# Altium project Digital Power Board Rev2.PrjPcb
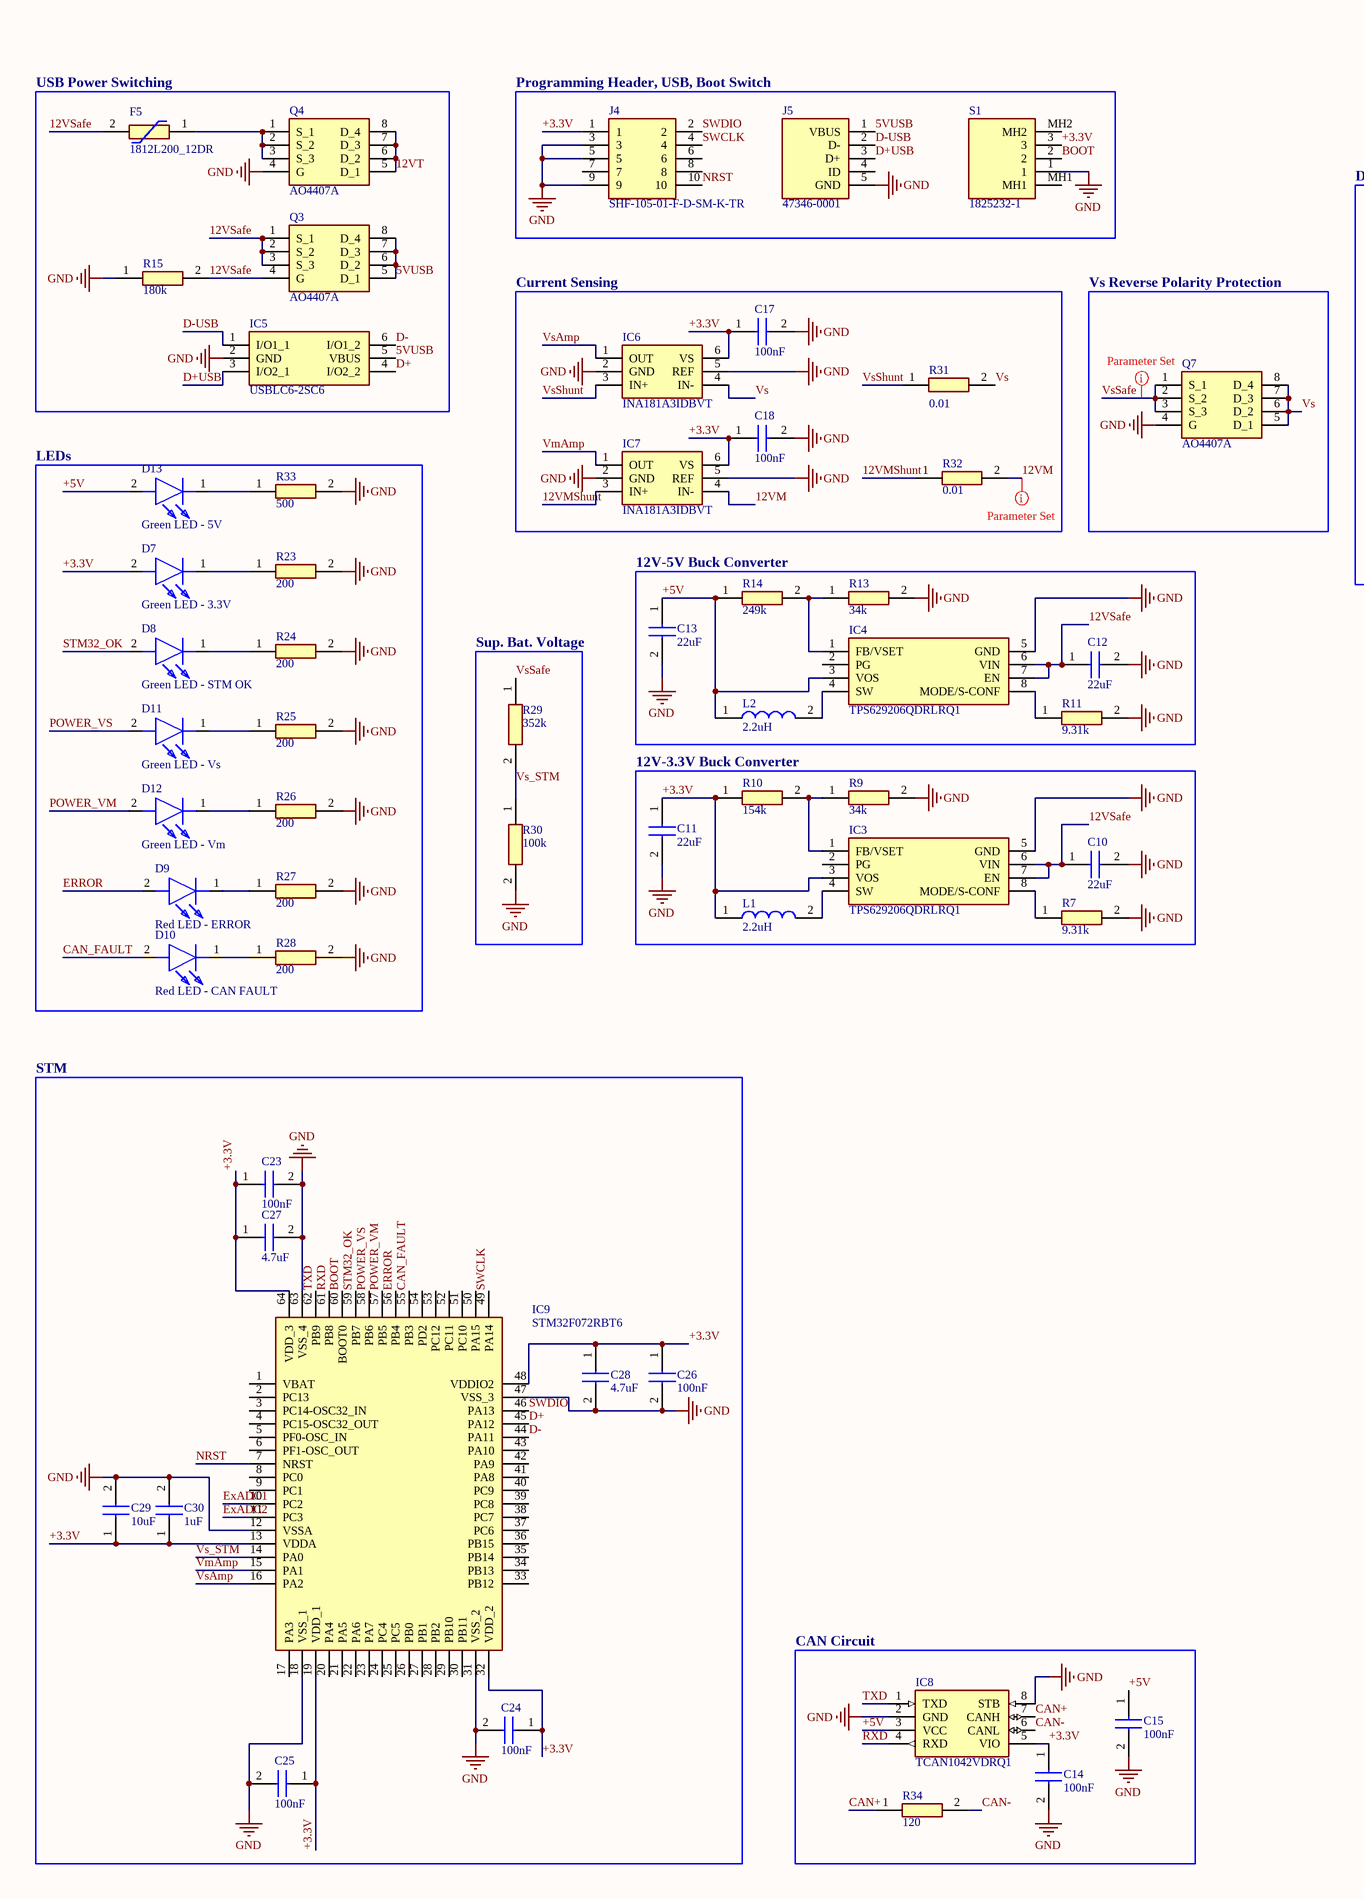
[diagram p0: PB-SG-Digital1-rev2.SchDoc, left]
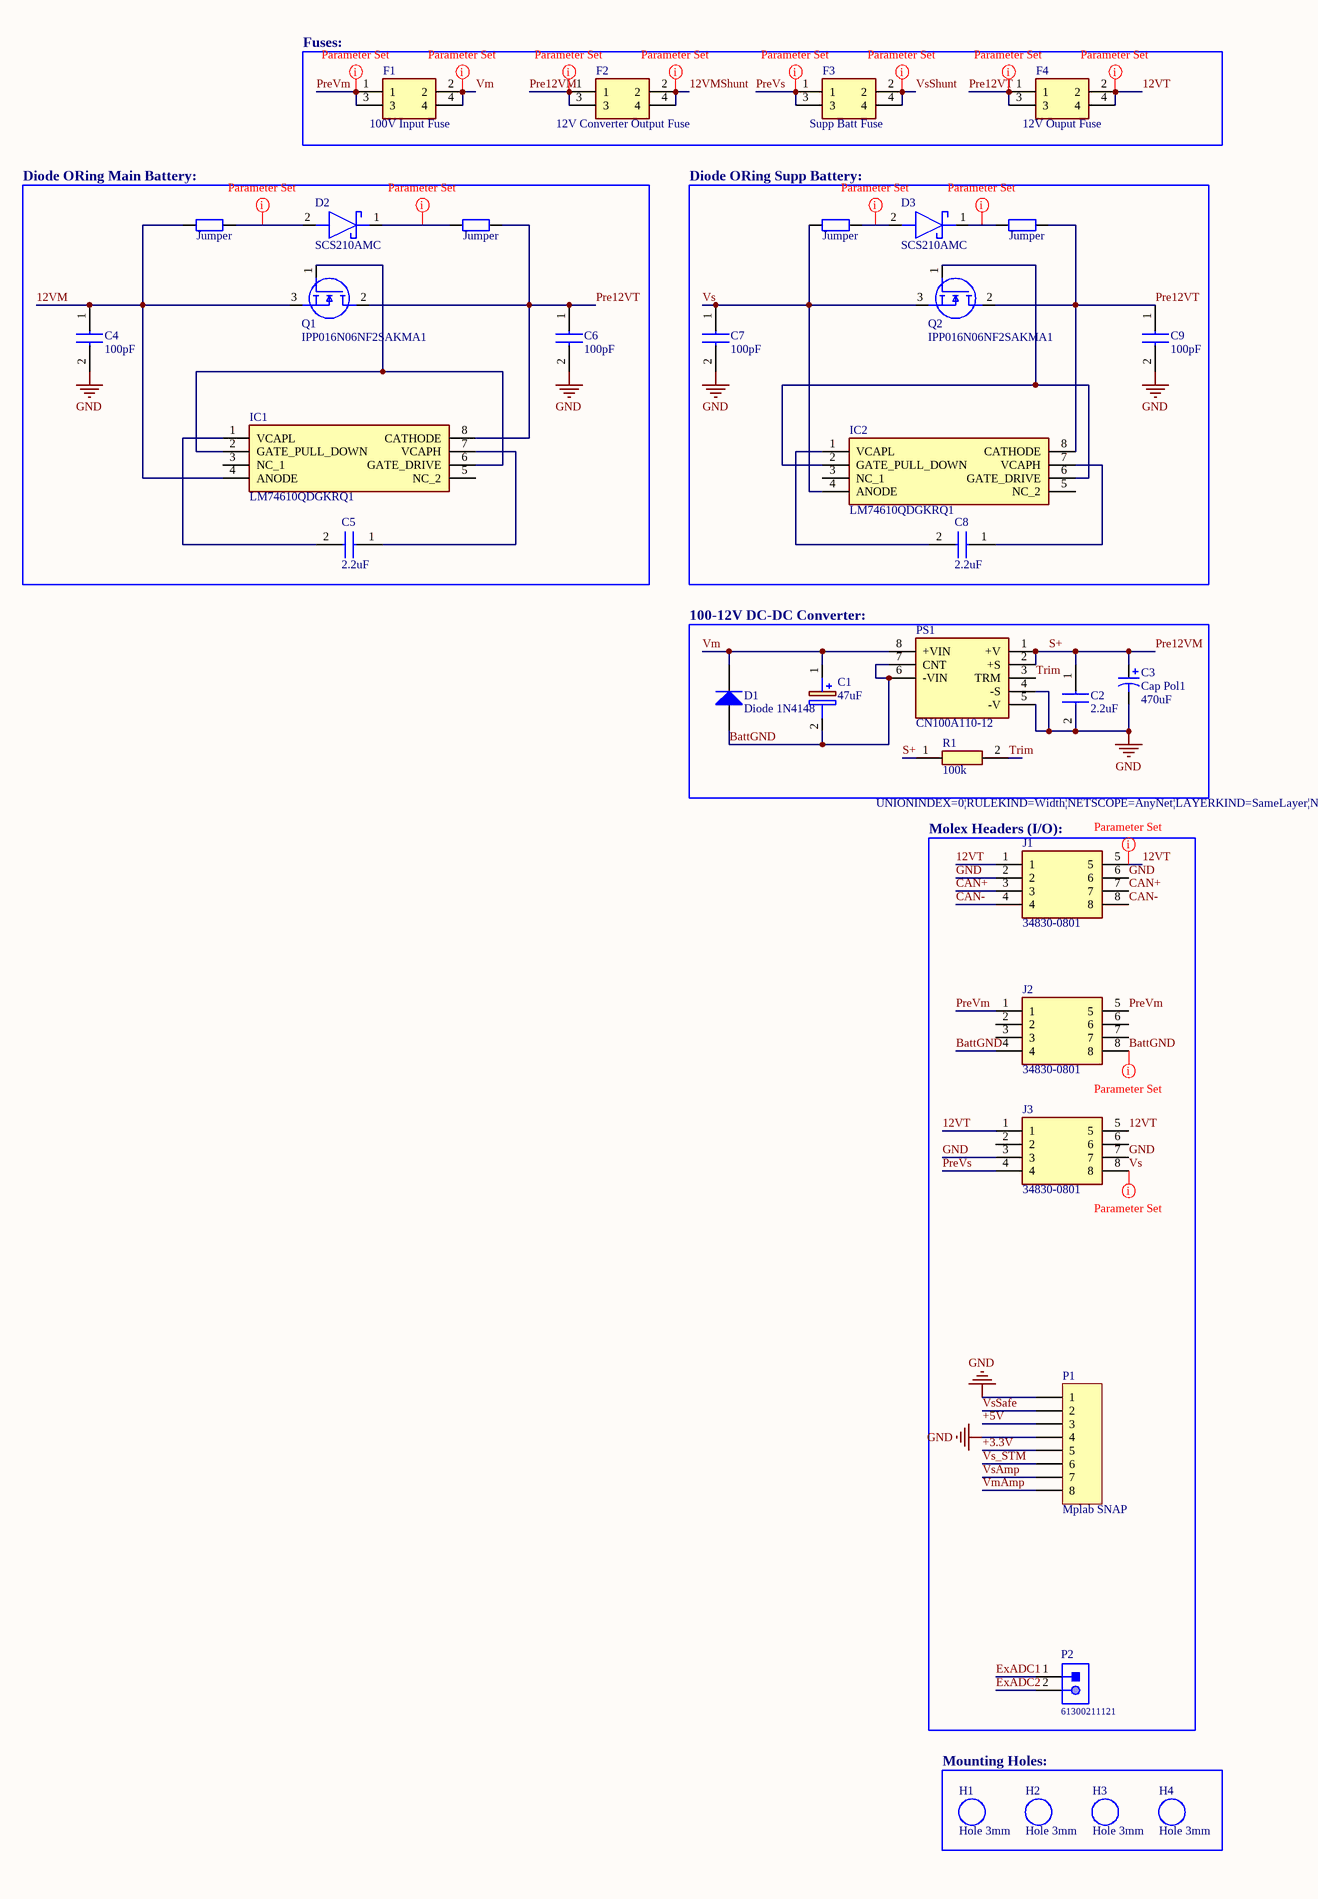
[diagram p1: PB-SG-Digital1-rev2.SchDoc, right]
1 sheet, 93 parts. Net scope: global (net labels, ports and power ports of the same name join across sheets).
Board file: PB-SG-Digital1-rev2.PcbDoc

## Sheet PB-SG-Digital1-rev2.SchDoc: Digital Power Board
size C; Author: Christian Michaelis; CompanyName: Solar Gators; Engineer: Christian Michaelis; Organization: Solar Gators; Address1: Christian Michaelis; Address2: Electrical Engineer; DocumentNumber: 1; Revision: 1; SheetNumber: 1; SheetTotal: 1; ImagePath: C:\Users\8jcm0\Downloads\solar logo.png

### Parts
C1  47uF  [CAPPRD500W60D1300H2200]
C2  2.2uF  [CAPC2012X95N]
C3  Cap Pol1  value 470uF  [CAPPRD750W80D1600H2700]
C4  100pF  [CAPC1005X55N]
C5  2.2uF  [CAPC2012X95N]
C6  100pF  [CAPC1005X55N]
C7  100pF  [CAPC1005X55N]
C8  2.2uF  [CAPC2012X95N]
C9  100pF  [CAPC1005X55N]
C10  22uF  [CAPC3225X270N]
C11  22uF  [CAPC2012X145N]
C12  22uF  [CAPC3225X270N]
C13  22uF  [CAPC2012X145N]
C14  100nF  [CAPC1005X55N]
C15  100nF  [CAPC1005X55N]
C17  100nF  [CAPC1005X55N]
C18  100nF  [CAPC1005X55N]
C23  100nF  [CAPC2012X95N]
C24  100nF  [CAPC2012X95N]
C25  100nF  [CAPC2012X95N]
C26  100nF  [CAPC2012X95N]
C27  4.7uF  [CAPC2012X95N]
C28  4.7uF  [CAPC2012X95N]
C29  10uF  [CAPC2012X95N]
C30  1uF  [CAPC2012X95N]
D1  Diode 1N4148  [DO-35]
D2  SCS210AMC  [TO508P470X1016X1905-2P]
D3  SCS210AMC  [TO508P470X1016X1905-2P]
D7  Green LED - 3.3V  [SMLMN2ECTT86C]
D8  Green LED - STM OK  [SMLMN2ECTT86C]
D9  Red LED - ERROR  [CSL1901UW1]
D10  Red LED - CAN FAULT  [CSL1901UW1]
D11  Green LED - Vs  [SMLMN2ECTT86C]
D12  Green LED - Vm  [SMLMN2ECTT86C]
D13  Green LED - 5V  [SMLMN2ECTT86C]
F1  100V Input Fuse  [3557-2]
F2  12V Converter Output Fuse  [3557-2]
F3  Supp Batt Fuse  [3557-2]
F4  12V Ouput Fuse  [3557-2]
F5  1812L200_12DR  [1812L010DR]
H1  Hole 3mm  [Hole 3mm]
H2  Hole 3mm  [Hole 3mm]
H3  Hole 3mm  [Hole 3mm]
H4  Hole 3mm  [Hole 3mm]
IC1  LM74610QDGKRQ1  [Smart Diode]
IC2  LM74610QDGKRQ1  [Smart Diode]
IC3  TPS629206QDRLRQ1  [SOTFL50P160X60-8N]
IC4  TPS629206QDRLRQ1  [SOTFL50P160X60-8N]
IC5  USBLC6-2SC6  [SOT95P280X145-6N]
IC6  INA181A3IDBVT  [SOT95P280X145-6N]
IC7  INA181A3IDBVT  [SOT95P280X145-6N]
IC8  TCAN1042VDRQ1  [SOIC127P600X175-8N]
IC9  STM32F072RBT6  [QFP50P1200X1200X160-64N]
J1  34830-0801  [MOLEX_34830-0801]
J2  34830-0801  [MOLEX_34830-0801]
J3  34830-0801  [MOLEX_34830-0801]
J4  SHF-105-01-F-D-SM-K-TR  [SHF10501FDSMKTR]
J5  47346-0001  [47346-0001]
Jump1  Jumper  [AXIAL-0.4]
Jump2  Jumper  [AXIAL-0.4]
Jump3  Jumper  [AXIAL-0.4]
Jump4  Jumper  [AXIAL-0.4]
L1  2.2uH  [LVS505040-2R2M-N]
L2  2.2uH  [LVS505040-2R2M-N]
P1  Mplab SNAP  [HDR1X8]
P2  61300211121  [61300211121]
PS1  CN100A110-12  [CN50A1105CO]
Q1  IPP016N06NF2SAKMA1  [TO254P475X1028X1996-3P]
Q2  IPP016N06NF2SAKMA1  [TO254P475X1028X1996-3P]
Q3  AO4407A  [SOIC127P600X175-8N]
Q4  AO4407A  [SOIC127P600X175-8N]
Q7  AO4407A  [SOIC127P600X175-8N]
R1  100k  [RESC3116X65N]
R7  9.31k  [RESC1005X40N]
R9  34k  [ERJS02_U02_(0402)]
R10  154k  [RESC1005X40N]
R11  9.31k  [RESC1005X40N]
R13  34k  [ERJS02_U02_(0402)]
R14  249k  [RESC1005X40N]
R15  180k  [RESC2012X60N]
R23  200  [RESC2012X60N]
R24  200  [RESC2012X60N]
R25  200  [RESC2012X60N]
R26  200  [RESC2012X60N]
R27  200  [RESC2012X60N]
R28  200  [RESC2012X60N]
R29  352k  [RESC2012X60N]
R30  100k  [RESC2012X60N]
R31  0.01  [RESC6432X145N]
R32  0.01  [RESC6432X145N]
R33  500  [RESC2012X60N]
R34  120  [RESC3116X65N]
S1  1825232-1  [18252321]

### Blocks framed on the sheet
USB Power Switching: F5 IC5 Q3 Q4 R15
Programming Header, USB, Boot Switch: J4 J5 S1
Fuses:: F1-F4
Diode ORing Main Battery:: C4-C6 D2 IC1 Jump1 Jump2 Q1
Diode ORing Supp Battery:: C7-C9 D3 IC2 Jump3 Jump4 Q2
Current Sensing: C17 C18 IC6 IC7 R31 R32
Vs Reverse Polarity Protection: Q7
LEDs: D7-D13 R23-R28 R33
12V-5V Buck Converter: C12 C13 IC4 L2 R11 R13 R14
100-12V DC-DC Converter:: C1-C3 D1 PS1 R1
Sup. Bat. Voltage: R29 R30
12V-3.3V Buck Converter: C10 C11 IC3 L1 R7 R9 R10
Molex Headers (I/O):: J1-J3 P1 P2
STM: C23-C30 IC9
CAN Circuit: C14 C15 IC8 R34
Mounting Holes:: H1-H4

### Nets
GND: C2.2 C3.2 C4.2 C6.2 C7.2 C9.2 C10.2 C11.2 C12.2 C13.2 C14.2 C15.2 C17.2 C18.2 C23.2 C24.2 C25.2 C26.2 C27.2 C28.2 C29.2 C30.2 IC3.5(GND) IC4.5(GND) IC5.2(GND) IC6.2(GND) IC6.5(REF) IC7.2(GND) IC7.5(REF) IC8.2(GND) IC8.8(STB) IC9.12(VSSA) IC9.18(VSS_1) IC9.31(VSS_2) IC9.47(VSS_3) IC9.63(VSS_4) J1.2 J1.6 J3.3 J3.7 J4.3 J4.5 J4.9 J5.5(GND) P1.1 P1.4 PS1.4(-S) PS1.5(-V) Q4.4(G) Q7.4(G) R7.2 R9.2 R11.2 R13.2 R15.1 R23.2 R24.2 R25.2 R26.2 R27.2 R28.2 R30.2 R33.2 S1.1
5VUSB: IC5.5(VBUS) J5.1(VBUS) Q3.5(D_1) Q3.6(D_2) Q3.7(D_3) Q3.8(D_4)
12VM: C4.1 IC1.4(ANODE) IC7.4(IN-) Jump1.1 Q1.3(S) R32.2
12VMShunt: F2.2 F2.4 IC7.3(IN+) R32.1
12VSafe: C10.1 C12.1 F5.2 IC3.6(VIN) IC3.7(EN) IC4.6(VIN) IC4.7(EN) Q3.1(S_1) Q3.2(S_2) Q3.3(S_3) Q3.4(G) R15.2
12VT: F4.2 F4.4 J1.1 J1.5 J3.1 J3.5 Q4.5(D_1) Q4.6(D_2) Q4.7(D_3) Q4.8(D_4)
+3.3V: C11.1 C14.1 C17.1 C18.1 C23.1 C24.1 C25.1 C26.1 C27.1 C28.1 C29.1 C30.1 D7.2(A) IC3.3(VOS) IC6.6(VS) IC7.6(VS) IC8.5(VIO) IC9.13(VDDA) IC9.19(VDD_1) IC9.32(VDD_2) IC9.48(VDDIO2) IC9.64(VDD_3) J4.1 L1.1 P1.5 R10.1 S1.3
+5V: C13.1 C15.1 D13.2(A) IC4.3(VOS) IC8.3(VCC) L2.1 P1.3 R14.1
BattGND: C1.2(-) D1.1(A) J2.4 J2.8 PS1.6(-VIN) PS1.7(CNT)
BOOT: IC9.60(BOOT0) S1.2
CAN+: IC8.7(CANH) J1.3 J1.7 R34.1
CAN-: IC8.6(CANL) J1.4 J1.8 R34.2
CAN_FAULT: D10.2(A) IC9.55(PB3)
D+: IC5.4(I/O2_2) IC9.45(PA12)
D+USB: IC5.3(I/O2_1) J5.3(D+)
D-: IC5.6(I/O1_2) IC9.44(PA11)
D-USB: IC5.1(I/O1_1) J5.2(D-)
ERROR: D9.2(A) IC9.56(PB4)
ExADC1: IC9.10(PC2) P2.1
ExADC2: IC9.11(PC3) P2.2
NRST: IC9.7(NRST) J4.10
POWER_VM: D12.2(A) IC9.57(PB5)
POWER_VS: D11.2(A) IC9.58(PB6)
Pre12VM: C2.1 C3.1 F2.1 F2.3 PS1.1(+V) PS1.2(+S) R1.1  [also labelled S+]
Pre12VT: C6.1 C9.1 F4.1 F4.3 IC1.8(CATHODE) IC2.8(CATHODE) Jump2.2 Jump4.2 Q1.2(D) Q2.2(D)
PreVm: F1.1 F1.3 J2.1 J2.5
PreVs: F3.1 F3.3 J3.4
RXD: IC8.4(RXD) IC9.61(PB8)
STM32_OK: D8.2(A) IC9.59(PB7)
SWCLK: IC9.49(PA14) J4.4
SWDIO: IC9.46(PA13) J4.2
Trim: PS1.3(TRM) R1.2
TXD: IC8.1(TXD) IC9.62(PB9)
Vm: C1.1(+) D1.2(K) F1.2 F1.4 PS1.8(+VIN)
VmAmp: IC7.1(OUT) IC9.15(PA1) P1.8
Vs: C7.1 IC2.4(ANODE) IC6.4(IN-) J3.8 Jump3.1 Q2.3(S) Q7.5(D_1) Q7.6(D_2) Q7.7(D_3) Q7.8(D_4) R31.2
Vs_STM: IC9.14(PA0) P1.6 R29.2 R30.1
VsAmp: IC6.1(OUT) IC9.16(PA2) P1.7
VsSafe: P1.2 Q7.1(S_1) Q7.2(S_2) Q7.3(S_3) R29.1
VsShunt: F3.2 F3.4 IC6.3(IN+) R31.1
NetC5_1: C5.1 IC1.7(VCAPH)
NetC5_2: C5.2 IC1.1(VCAPL)
NetC8_1: C8.1 IC2.7(VCAPH)
NetC8_2: C8.2 IC2.1(VCAPL)
NetD2_1: D2.1(K) Jump2.1
NetD2_2: D2.2(A) Jump1.2
NetD3_1: D3.1(K) Jump4.1
NetD3_2: D3.2(A) Jump3.2
NetD7_1: D7.1(K) R23.1
NetD8_1: D8.1(K) R24.1
NetD9_1: D9.1(K) R27.1
NetD10_1: D10.1(K) R28.1
NetD11_1: D11.1(K) R25.1
NetD12_1: D12.1(K) R26.1
NetD13_1: D13.1(K) R33.1
NetF5_1: F5.1 Q4.1(S_1) Q4.2(S_2) Q4.3(S_3)
NetIC1_2: IC1.2(GATE_PULL_DOWN) IC1.6(GATE_DRIVE) Q1.1(G)
NetIC2_2: IC2.2(GATE_PULL_DOWN) IC2.6(GATE_DRIVE) Q2.1(G)
NetIC3_1: IC3.1(FB/VSET) R9.1 R10.2
NetIC3_4: IC3.4(SW) L1.2
NetIC3_8: IC3.8(MODE/S-CONF) R7.1
NetIC4_1: IC4.1(FB/VSET) R13.1 R14.2
NetIC4_4: IC4.4(SW) L2.2
NetIC4_8: IC4.8(MODE/S-CONF) R11.1

Not connected (* = marked no-connect by the designer): IC1 3(NC_1) 5(NC_2); IC2 3(NC_1) 5(NC_2); IC3 2(PG); IC4 2(PG); IC9 1(VBAT) 2(PC13) 3(PC14-OSC32_IN) 4(PC15-OSC32_OUT) 5(PF0-OSC_IN) 6(PF1-OSC_OUT) 8(PC0) 9(PC1) 17(PA3) 20(PA4) 21(PA5) 22(PA6) 23(PA7) 24(PC4) 25(PC5) 26(PB0) 27(PB1) 28(PB2) 29(PB10) 30(PB11) 33(PB12) 34(PB13) 35(PB14) 36(PB15) 37(PC6) 38(PC7) 39(PC8) 40(PC9) 41(PA8) 42(PA9) 43(PA10) 50(PA15) 51(PC10) 52(PC11) 53(PC12) 54(PD2); J2 2 3 6 7; J3 2 6; J4 6 7 8; J5 4(ID); S1 MH1 MH2

### Layout directives
rule Width Constraint [Pref Width = 50mil    Min Width = 25mil    Max Width = 60mil]: 12VM, 12VMShunt, 12VT, BattGND, NetD2_1, NetD2_2, NetD3_1, NetD3_2, Pre12VM, PreVm, PreVs, Vm, Vs, VsShunt
rule Width Constraint [Pref Width = 50mil    Min Width = 10mil    Max Width = 60mil]: Pre12VT
rule Width Constraint [Pref Width = 60mil    Min Width = 40mil    Max Width = 60mil]: 12VT
rule Width Constraint [Pref Width = 10mil    Min Width = 10mil    Max Width = 25mil]: VsSafe

### Notes on the sheet
- Title
- Size:
- Date:
- File:
- C
- Number:
- Time:
- Revision:
- Sheet
- of

### Library data of the parts
C1 = UCS2E470MHD1TO: Capacitor Polarised UCS2E470MHD1TO; Manufacturer_Name: Nichicon; Datasheet Link: http://www.nichicon.co.jp/english/products/pdfs/e-ucs.pdf; Height: 22mm; Manufacturer_Part_Number: UCS2E470MHD1TO; Mouser Part Number: 647-UCS2E470MHD1TO; Mouser Price/Stock: https://www.mouser.com/Search/Refine.aspx?Keyword=647-UCS2E470MHD1TO; Arrow Part Number: UCS2E470MHD1TO; Arrow Price/Stock: https://www.arrow.com/en/products/ucs2e470mhd1to/nichicon
C2 C5 C8 = CC0805KRX7R9BB104: C19110   Capacitor  CL21B225KAFNNNE; Manufacturer_Name: YAGEO; Datasheet Link: https://www.yageo.com/upload/media/product/productsearch/datasheet/mlcc/UPY-GPHC_X7R_6.3V-to-50V_20.pdf; Height: 0.95mm; Manufacturer_Part_Number: CC0805KRX7R9BB104; Mouser Part Number: 603-CC805KRX7R9BB104; Mouser Price/Stock: https://www.mouser.co.uk/ProductDetail/YAGEO/CC0805KRX7R9BB104?qs=vTakOoo5QyLx0lXWgVtRhQ%3D%3D; Arrow Part Number: CC0805KRX7R9BB104; Arrow Price/Stock: https://www.arrow.com/en/products/cc0805krx7r9bb104/yageo?region=europe
C3 = Cap Pol1: Polarized Capacitor (Radial); Published: 8-Jun-2000; LatestRevisionDate: 17-Jul-2002; LatestRevisionNote: Re-released for DXP Platform.; PackageReference: RB7.6-15; Publisher: Altium Limited; PackageDescription: Polarized Capacitor (Radial); 2 Leads
C4 C6 C7 C9 = CC0402KRX5R6BB104: C26409   CL05C101JB5NNNC; Manufacturer_Name: KEMET; Datasheet Link: https://datasheet.datasheetarchive.com/originals/distributors/Datasheets_SAMA/c9edbbb71d7164f160019236c84d742e.pdf; Height: 0.55mm; Manufacturer_Part_Number: CC0402KRX5R6BB104; Mouser Part Number: 603-CC402KRX5R6BB104; Mouser Price/Stock: https://www.mouser.co.uk/ProductDetail/Yageo/CC0402KRX5R6BB104?qs=AgBp2OyFlx%2FuUdVgPlpdxg%3D%3D; Arrow Part Number: CC0402KRX5R6BB104; Arrow Price/Stock: https://www.arrow.com/en/products/cc0402krx5r6bb104/yageo
C10 C12 = GRM32ER61E226KE15L: C65428; Manufacturer_Name: Murata Electronics; Datasheet Link: http://psearch.en.murata.com/capacitor/product/GRM32ER71E226KE15%23.pdf; Height: 2.7mm; Manufacturer_Part_Number: GRM32ER61E226KE15L; Mouser Part Number: 81-GRM32ER61E226KE15; Mouser Price/Stock: https://www.mouser.co.uk/ProductDetail/Murata-Electronics/GRM32ER61E226KE15L?qs=CHiu0TXTCq%252Bo%252Bcqcz70txw%3D%3D; Arrow Part Number: GRM32ER61E226KE15L; Arrow Price/Stock: https://www.arrow.com/en/products/grm32er61e226ke15l/murata-manufacturing?region=nac
C11 C13 = GRM21BR61A226ME44L: C45783; Manufacturer_Name: Murata Electronics; Datasheet Link: http://www.murata.com/~/media/webrenewal/support/library/catalog/products/capacitor/mlcc/c02e.pdf; Height: 1.45mm; Manufacturer_Part_Number: GRM21BR61A226ME44L; Mouser Part Number: 81-GRM21BR61A226ME4L; Mouser Price/Stock: https://www.mouser.co.uk/ProductDetail/Murata-Electronics/GRM21BR61A226ME44L?qs=eeBpzGFlv%252B8tSfxib2AMhw%3D%3D; Arrow Part Number: GRM21BR61A226ME44L; Arrow Price/Stock: https://www.arrow.com/en/products/grm21br61a226me44l/murata-manufacturing?region=nac
C14 C15 C17 C18 = CC0402KRX5R6BB104: C129131; Manufacturer_Name: KEMET; Datasheet Link: https://datasheet.datasheetarchive.com/originals/distributors/Datasheets_SAMA/c9edbbb71d7164f160019236c84d742e.pdf; Height: 0.55mm; Manufacturer_Part_Number: CC0402KRX5R6BB104; Mouser Part Number: 603-CC402KRX5R6BB104; Mouser Price/Stock: https://www.mouser.co.uk/ProductDetail/Yageo/CC0402KRX5R6BB104?qs=AgBp2OyFlx%2FuUdVgPlpdxg%3D%3D; Arrow Part Number: CC0402KRX5R6BB104; Arrow Price/Stock: https://www.arrow.com/en/products/cc0402krx5r6bb104/yageo
C23-C26 = CC0805KRX7R9BB104: C49678   Capacitor; Manufacturer_Name: YAGEO; Datasheet Link: https://www.yageo.com/upload/media/product/productsearch/datasheet/mlcc/UPY-GPHC_X7R_6.3V-to-50V_20.pdf; Height: 0.95mm; Manufacturer_Part_Number: CC0805KRX7R9BB104; Mouser Part Number: 603-CC805KRX7R9BB104; Mouser Price/Stock: https://www.mouser.co.uk/ProductDetail/YAGEO/CC0805KRX7R9BB104?qs=vTakOoo5QyLx0lXWgVtRhQ%3D%3D; Arrow Part Number: CC0805KRX7R9BB104; Arrow Price/Stock: https://www.arrow.com/en/products/cc0805krx7r9bb104/yageo?region=europe
C27 C28 = CC0805KRX7R9BB104: C1779   Capacitor  CL21A475KAQNNNE; Manufacturer_Name: YAGEO; Datasheet Link: https://www.yageo.com/upload/media/product/productsearch/datasheet/mlcc/UPY-GPHC_X7R_6.3V-to-50V_20.pdf; Height: 0.95mm; Manufacturer_Part_Number: CC0805KRX7R9BB104; Mouser Part Number: 603-CC805KRX7R9BB104; Mouser Price/Stock: https://www.mouser.co.uk/ProductDetail/YAGEO/CC0805KRX7R9BB104?qs=vTakOoo5QyLx0lXWgVtRhQ%3D%3D; Arrow Part Number: CC0805KRX7R9BB104; Arrow Price/Stock: https://www.arrow.com/en/products/cc0805krx7r9bb104/yageo?region=europe
C29 = CC0805KRX7R9BB104: C84416   Capacitor  GRM21BR61E106KA73L; Manufacturer_Name: YAGEO; Datasheet Link: https://www.yageo.com/upload/media/product/productsearch/datasheet/mlcc/UPY-GPHC_X7R_6.3V-to-50V_20.pdf; Height: 0.95mm; Manufacturer_Part_Number: CC0805KRX7R9BB104; Mouser Part Number: 603-CC805KRX7R9BB104; Mouser Price/Stock: https://www.mouser.co.uk/ProductDetail/YAGEO/CC0805KRX7R9BB104?qs=vTakOoo5QyLx0lXWgVtRhQ%3D%3D; Arrow Part Number: CC0805KRX7R9BB104; Arrow Price/Stock: https://www.arrow.com/en/products/cc0805krx7r9bb104/yageo?region=europe
C30 = CC0805KRX7R9BB104: C24123   Capacitor  CL21B105KOFNNNE; Manufacturer_Name: YAGEO; Datasheet Link: https://www.yageo.com/upload/media/product/productsearch/datasheet/mlcc/UPY-GPHC_X7R_6.3V-to-50V_20.pdf; Height: 0.95mm; Manufacturer_Part_Number: CC0805KRX7R9BB104; Mouser Part Number: 603-CC805KRX7R9BB104; Mouser Price/Stock: https://www.mouser.co.uk/ProductDetail/YAGEO/CC0805KRX7R9BB104?qs=vTakOoo5QyLx0lXWgVtRhQ%3D%3D; Arrow Part Number: CC0805KRX7R9BB104; Arrow Price/Stock: https://www.arrow.com/en/products/cc0805krx7r9bb104/yageo?region=europe
D1 = Diode 1N4148: High Conductance Fast Diode; Published: 8-Jun-2000; LatestRevisionDate: 17-Jul-2002; LatestRevisionNote: Re-released for DXP Platform.; DatasheetVersion: 1997; PackageReference: DO-35; Publisher: Altium Limited; PackageDescription: Diode, Axial; Body 3.8 x 1.9 mm (LxDia. max), Lead Dia. 0.53 mm (max); Code_JEDEC: DO-204-AH; ComponentLink1Description: Manufacturer Link; ComponentLink1URL: http://www.fairchildsemi.com/; ComponentLink2Description: Datasheet; ComponentLink2URL: http://www.fairchildsemi.com/ds/1N%2F1N4148.pdf
D2 D3 = SCS210AMC: Schottky Diode; Manufacturer_Name: ROHM Semiconductor; Datasheet Link: https://componentsearchengine.com/Datasheets/2/SCS210AMC.pdf; Height: 4.7mm; Manufacturer_Part_Number: SCS210AMC; Mouser Part Number: 755-SCS210AMC; Mouser Price/Stock: https://www.mouser.co.uk/ProductDetail/ROHM-Semiconductor/SCS210AMC?qs=IDm2WsMLa1WEPB2seV%252Bn2Q%3D%3D
D7 D8 D11-D13 = SMLMN2ECTT86C: C2297   LED; Manufacturer_Name: ROHM Semiconductor; Datasheet Link: https://fscdn.rohm.com/en/products/databook/datasheet/opto/led/chip_mono/sml-mn2x(c)-e.pdf; Height: 1mm; Manufacturer_Part_Number: SMLMN2ECTT86C; Mouser Part Number: 755-SMLMN2ECTT86C; Mouser Price/Stock: https://www.mouser.co.uk/ProductDetail/ROHM-Semiconductor/SMLMN2ECTT86C?qs=YCa%2FAAYMW03zoNRTOAxGsA%3D%3D
D9 D10 = CSL1901UW1: LED  C2286; Manufacturer_Name: ROHM Semiconductor; Datasheet Link: https://www.mouser.kr/datasheet/2/348/csl1901uw1_e-3006038.pdf; Height: 0.65mm; Manufacturer_Part_Number: CSL1901UW1; Mouser Part Number: 755-CSL1901UW1; Mouser Price/Stock: https://www.mouser.co.uk/ProductDetail/ROHM-Semiconductor/CSL1901UW1?qs=vvQtp7zwQdNEDNe2oY5WlQ%3D%3D
F1 F2 = 3557-2: 3557-2 Fuse Holder; Manufacturer_Name: Keystone Electronics; Datasheet Link: http://www.keyelco.com/product-pdf.cfm?p=296; Manufacturer_Part_Number: 3557-2; Mouser Part Number: 534-3557-2; Mouser Price/Stock: https://www.mouser.co.uk/ProductDetail/Keystone-Electronics/3557-2?qs=cxy41lVAGV%2FfbyASjpXK1g%3D%3D; Arrow Part Number: 3557-2; Arrow Price/Stock: https://www.arrow.com/en/products/3557-2/keystone-electronics?region=europe
F3 F4 = 3557-2: Connector; Manufacturer_Name: Keystone Electronics; Datasheet Link: http://www.keyelco.com/product-pdf.cfm?p=296; Manufacturer_Part_Number: 3557-2; Mouser Part Number: 534-3557-2; Mouser Price/Stock: https://www.mouser.co.uk/ProductDetail/Keystone-Electronics/3557-2?qs=cxy41lVAGV%2FfbyASjpXK1g%3D%3D; Arrow Part Number: 3557-2; Arrow Price/Stock: https://www.arrow.com/en/products/3557-2/keystone-electronics?region=europe
F5 = 1812L200_12DR: C209723 Resettable Fuse; Manufacturer_Name: LITTELFUSE; Manufacturer_Part_Number: 1812L200/12DR; Datasheet Link: http://www.littelfuse.com/~/media/electronics/datasheets/resettable_ptcs/littelfuse_ptc_1812l_datasheet.pdf.pdf; Height: 1.25mm; Mouser Part Number: 576-1812L200/12DR; Mouser Price/Stock: https://www.mouser.co.uk/ProductDetail/Littelfuse/1812L200-12DR?qs=Vv6sT79n3zRLU3%252BVqAw1nQ%3D%3D; Arrow Part Number: 1812L200/12DR; Arrow Price/Stock: https://www.arrow.com/en/products/1812l20012dr/littelfuse?region=nac
IC1 IC2 = LM74610QDGKRQ1: Integrated Circuit; Manufacturer_Name: Texas Instruments; Datasheet Link: http://www.ti.com/lit/gpn/lm74610-q1; Height: 1.1mm; Manufacturer_Part_Number: LM74610QDGKRQ1; Mouser Part Number: 595-LM74610QDGKRQ1; Mouser Price/Stock: https://www.mouser.co.uk/ProductDetail/Texas-Instruments/LM74610QDGKRQ1?qs=3jdCaFhktOQTVpuuubgDqg%3D%3D; Arrow Part Number: LM74610QDGKRQ1; Arrow Price/Stock: https://www.arrow.com/en/products/lm74610qdgkrq1/texas-instruments
IC3 IC4 = TPS629206QDRLRQ1: Integrated Circuit; Manufacturer_Name: Texas Instruments; Datasheet Link: https://www.ti.com/lit/gpn/TPS629206-Q1; Height: 0.6mm; Manufacturer_Part_Number: TPS629206QDRLRQ1; Mouser Part Number: 595-TPS629206QDRLRQ1; Mouser Price/Stock: https://www.mouser.co.uk/ProductDetail/Texas-Instruments/TPS629206QDRLRQ1?qs=Znm5pLBrcAKSjTz%252BzqwnCQ%3D%3D
IC5 = USBLC6-2SC6: C5180249; Manufacturer_Name: STMicroelectronics; Datasheet Link: http://www.st.com/st-web-ui/static/active/en/resource/technical/document/datasheet/CD00050750.pdf; Height: 1.45mm; Manufacturer_Part_Number: USBLC6-2SC6; Mouser Part Number: 511-USBLC6-2SC6; Mouser Price/Stock: https://www.mouser.co.uk/ProductDetail/STMicroelectronics/USBLC6-2SC6?qs=po45yt2pPpu%2FhNIlwQdTlg%3D%3D; Arrow Part Number: USBLC6-2SC6; Arrow Price/Stock: https://www.arrow.com/en/products/usblc6-2sc6/stmicroelectronics?region=nac
IC6 IC7 = INA181A3IDBVT: C129285; Manufacturer_Name: Texas Instruments; Datasheet Link: http://www.ti.com/lit/gpn/ina181; Height: 1.45mm; Manufacturer_Part_Number: INA181A3IDBVT; Mouser Part Number: 595-INA181A3IDBVT; Mouser Price/Stock: https://www.mouser.co.uk/ProductDetail/Texas-Instruments/INA181A3IDBVT?qs=5aG0NVq1C4xDYw%252BwDbhXfg%3D%3D; Arrow Part Number: INA181A3IDBVT; Arrow Price/Stock: https://www.arrow.com/en/products/ina181a3idbvt/texas-instruments?region=nac
IC8 = TCAN1042VDRQ1: Integrated Circuit; Manufacturer_Name: Texas Instruments; Datasheet Link: http://www.ti.com/lit/ds/symlink/tcan1042-q1.pdf; Height: 1.75mm; Manufacturer_Part_Number: TCAN1042VDRQ1; Mouser Part Number: 595-TCAN1042VDRQ1; Mouser Price/Stock: https://www.mouser.co.uk/ProductDetail/Texas-Instruments/TCAN1042VDRQ1?qs=yDQnu9hAfI8tOcvXruCEuA%3D%3D; Arrow Part Number: TCAN1042VDRQ1; Arrow Price/Stock: https://www.arrow.com/en/products/tcan1042vdrq1/texas-instruments
IC9 = STM32F072RBT6: C46046 Integrated Circuit; Manufacturer_Name: STMicroelectronics; Datasheet Link: http://www.st.com/st-web-ui/static/active/en/resource/technical/document/datasheet/DM00090510.pdf; Height: 1.6mm; Manufacturer_Part_Number: STM32F072RBT6; Mouser Part Number: 511-STM32F072RBT6; Mouser Price/Stock: https://www.mouser.co.uk/ProductDetail/STMicroelectronics/STM32F072RBT6?qs=xf9JV0PLFEcuk6sTlnutaw%3D%3D; Arrow Part Number: STM32F072RBT6; Arrow Price/Stock: https://www.arrow.com/en/products/stm32f072rbt6/stmicroelectronics
J1-J3 = 34830-0801: Connector Header Through Hole, Right Angle 8 position 0.138 (3.50mm); MF: Molex; Check_prices: https://www.snapeda.com/parts/34830-0801/Molex/view-part/?ref=eda; Value: *; Availability: In Stock; MP: 34830-0801; Price: None; Package: None; SnapEDA_Link: https://www.snapeda.com/parts/34830-0801/Molex/view-part/?ref=snap; Purchase-URL: https://pricing.snapeda.com/search/part/34830-0801/?ref=eda
J4 = SHF-105-01-F-D-SM-K-TR: Connector; Manufacturer_Name: SAMTEC; Datasheet Link: http://suddendocs.samtec.com/prints/shf-1xx-01-x-d-xx-xx-mkt.pdf; Height: 5.33mm; Manufacturer_Part_Number: SHF-105-01-F-D-SM-K-TR; Mouser Part Number: 200-SHF10501FDSMKTR; Mouser Price/Stock: https://www.mouser.co.uk/ProductDetail/Samtec/SHF-105-01-F-D-SM-K-TR?qs=%252BZP6%2F%252BtExtBfJ7cPA6PDkA%3D%3D; Arrow Part Number: SHF-105-01-F-D-SM-K-TR; Arrow Price/Stock: https://www.arrow.com/en/products/shf-105-01-f-d-sm-k-tr/samtec?region=nac
J5 = 47346-0001: C132560; Manufacturer_Name: Molex; Datasheet Link: http://www.molex.com/pdm_docs/sd/473460001_sd.pdf; Manufacturer_Part_Number: 47346-0001; Mouser Part Number: 538-47346-0001; Mouser Price/Stock: https://www.mouser.co.uk/ProductDetail/Molex/47346-0001?qs=c2CV6XM0DweJBWaSeyWeCw%3D%3D
Jump1-Jump4 = Res2: Resistor; Published: 8-Jun-2000; LatestRevisionDate: 17-Jul-2002; LatestRevisionNote: Re-released for DXP Platform.; PackageReference: AXIAL-0.4; Publisher: Altium Limited; PackageDescription: Axial Device, Thru-Hole; 2 Leads; 0.4 in Pin Spacing
L1 L2 = PA4332.222NLT: C280539; Manufacturer_Name: Pulse; Datasheet Link: https://datasheet.datasheetarchive.com/originals/distributors/DKDS-10/182650.pdf; Height: 2mm; Manufacturer_Part_Number: PA4332.222NLT; Mouser Part Number: 673-PA4332222NLT; Mouser Price/Stock: https://www.mouser.co.uk/ProductDetail/Pulse-Electronics/PA4332.222NLT?qs=%2FzQKu7YvIMbE5ttuY4d%2Fzg%3D%3D; Arrow Part Number: PA4332.222NLT; Arrow Price/Stock: https://www.arrow.com/en/products/pa4332.222nlt/pulse-electronics-corporation?region=nac
P1 = Header 8: Header, 8-Pin; LatestRevisionDate: 17-Jul-2002; LatestRevisionNote: Re-released for DXP Platform.; Publisher: Altium Limited
P2 = CMP-1712-00002-4: THT Vertical Pin Header WR-PHD, Pitch 2.54 mm, Single Row, 2 pins; Manufacturer: Wurth Elektronik; Rated Current: 3A; Gender: Male; Withstanding Voltage: 500VAC; Working Voltage: 250VAC; Pitch: 2.54mm; Contact Resistance: 20mOhm; Pin Number: 2; Mounting Technology: THT; Orientation: Vertical; Operating Temperature: -40to105degC; Packaging: Bag; Publisher: WurthElektronik; Datasheet URL: https://katalog.we-online.de/em/datasheet/6130xx11121.pdf; Manufacturer URL: http://www.we-online.de; Row Number: Single; Package Reference: 61300211121; Part Number: 61300211121
PS1 = CN100A110-12: Power Supply; Manufacturer_Name: TDK; Datasheet Link: https://product.tdk.com/system/files/dam/doc/product/power/switching-power/dc-dc-converter/catalog/cn-a110_e.pdf; Height: 13.2mm; Manufacturer_Part_Number: CN100A110-12
Q1 Q2 = IPP016N06NF2SAKMA1: MOSFET (N-Channel); Manufacturer_Name: Infineon; Datasheet Link: https://nl.mouser.com/datasheet/2/196/Infineon_IPP016N06NF2S_DataSheet_v02_01_EN-3084796.pdf; Height: 4.75mm; Manufacturer_Part_Number: IPP016N06NF2SAKMA1; Mouser Part Number: 726-P016N06NF2SAKMA1; Mouser Price/Stock: https://www.mouser.co.uk/ProductDetail/Infineon-Technologies/IPP016N06NF2SAKMA1?qs=vvQtp7zwQdO2%252BKgNgsNqYA%3D%3D
Q3 Q4 Q7 = AO4407A: C16072; Manufacturer_Name: Alpha & Omega Semiconductors; Datasheet Link: http://aosmd.com/res/data_sheets/AO4407A.pdf; Height: 1.75mm; Manufacturer_Part_Number: AO4407A; Arrow Part Number: AO4407A; Arrow Price/Stock: https://www.arrow.com/en/products/ao4407a/alpha-and-omega-semiconductor?region=nac
R1 = CRM1206QFX-1003ELF: C406727   Resistor; Manufacturer_Name: Bourns; Datasheet Link: http://www.bourns.com/docs/Product-Datasheets/CRM-Q.pdf; Height: 0.65mm; Manufacturer_Part_Number: CRM1206QFX-1003ELF; Mouser Part Number: 652-CRM1206QFX-1003E; Mouser Price/Stock: https://www.mouser.co.uk/ProductDetail/Bourns/CRM1206QFX-1003ELF?qs=8Wlm6%252BaMh8RndkZYFfPU1w%3D%3D; Arrow Part Number: CRM1206QFX-1003ELF; Arrow Price/Stock: https://www.arrow.com/en/products/crm1206qfx-1003elf/bourns?region=nac
R7 R11 = CRCW04029K31FKED: C881302; Manufacturer_Name: Vishay; Datasheet Link: http://www.vishay.com/docs/20035/dcrcwe3.pdf; Height: 0.4mm; Manufacturer_Part_Number: CRCW04029K31FKED; Mouser Part Number: 71-CRCW0402-9.31K-E3; Mouser Price/Stock: https://www.mouser.com/Search/Refine.aspx?Keyword=71-CRCW0402-9.31K-E3
R9 R13 = ERJ-U02D3402X: C412507; Manufacturer_Name: Panasonic; Datasheet Link: https://industrial.panasonic.com/cdbs/www-data/pdf/RDP0000/AOA0000C334.pdf; Height: 0.4mm; Manufacturer_Part_Number: ERJ-U02D3402X
R10 = CRCW0402154KFKED: C226791; Manufacturer_Name: Vishay; Datasheet Link: http://www.vishay.com/docs/20035/dcrcwe3.pdf; Height: 0.4mm; Manufacturer_Part_Number: CRCW0402154KFKED
R14 = RC0402FR-07249KL: C163476; Manufacturer_Name: KEMET; Datasheet Link: http://www.yageo.com/documents/recent/PYu-RC0402_51_RoHS_L_6_r.pdf; Height: 0.4mm; Manufacturer_Part_Number: RC0402FR-07249KL
R15 = CR0805-FX-1243ELF: C17501; Manufacturer_Name: Bourns; Datasheet Link: https://www.bourns.com/pdfs/chpreztr.pdf; Height: 0.6mm; Manufacturer_Part_Number: CR0805-FX-1243ELF; Mouser Part Number: 652-CR0805FX-1243ELF; Mouser Price/Stock: https://www.mouser.com/Search/Refine.aspx?Keyword=652-CR0805FX-1243ELF
R23-R28 = CR0805-FX-1243ELF: C17540  RTT05101JTP; Manufacturer_Name: Bourns; Datasheet Link: https://www.bourns.com/pdfs/chpreztr.pdf; Height: 0.6mm; Manufacturer_Part_Number: CR0805-FX-1243ELF; Mouser Part Number: 652-CR0805FX-1243ELF; Mouser Price/Stock: https://www.mouser.com/Search/Refine.aspx?Keyword=652-CR0805FX-1243ELF
R29 = CR0805-FX-1243ELF: C422745   0805W8F3523T5E; Manufacturer_Name: Bourns; Datasheet Link: https://www.bourns.com/pdfs/chpreztr.pdf; Height: 0.6mm; Manufacturer_Part_Number: CR0805-FX-1243ELF; Mouser Part Number: 652-CR0805FX-1243ELF; Mouser Price/Stock: https://www.mouser.com/Search/Refine.aspx?Keyword=652-CR0805FX-1243ELF
R30 = CR0805-FX-1243ELF: C96346 / RC0805FR-07100KL; Manufacturer_Name: Bourns; Datasheet Link: https://www.bourns.com/pdfs/chpreztr.pdf; Height: 0.6mm; Manufacturer_Part_Number: CR0805-FX-1243ELF; Mouser Part Number: 652-CR0805FX-1243ELF; Mouser Price/Stock: https://www.mouser.com/Search/Refine.aspx?Keyword=652-CR0805FX-1243ELF
R31 R32 = CSNL2512FT10L0: Resistor; Manufacturer_Name: Stackpole Electronics; Datasheet Link: https://cs.seielect.com/catalog/SEI-CSNL.pdf; Height: 1.45mm; Manufacturer_Part_Number: CSNL2512FT10L0; Arrow Part Number: CSNL2512FT10L0; Arrow Price/Stock: https://www.arrow.com/en/products/csnl2512ft10l0/stackpole-electronics
R33 = CR0805-FX-1243ELF: C2828857  0805W8J0102T5E; Manufacturer_Name: Bourns; Datasheet Link: https://www.bourns.com/pdfs/chpreztr.pdf; Height: 0.6mm; Manufacturer_Part_Number: CR0805-FX-1243ELF; Mouser Part Number: 652-CR0805FX-1243ELF; Mouser Price/Stock: https://www.mouser.com/Search/Refine.aspx?Keyword=652-CR0805FX-1243ELF
R34 = CRM1206QFX-1003ELF: C17957  Resistor; Manufacturer_Name: Bourns; Datasheet Link: http://www.bourns.com/docs/Product-Datasheets/CRM-Q.pdf; Height: 0.65mm; Manufacturer_Part_Number: CRM1206QFX-1003ELF; Mouser Part Number: 652-CRM1206QFX-1003E; Mouser Price/Stock: https://www.mouser.co.uk/ProductDetail/Bourns/CRM1206QFX-1003ELF?qs=8Wlm6%252BaMh8RndkZYFfPU1w%3D%3D; Arrow Part Number: CRM1206QFX-1003ELF; Arrow Price/Stock: https://www.arrow.com/en/products/crm1206qfx-1003elf/bourns?region=nac
S1 = 1825232-1: Switch; Manufacturer_Name: TE Connectivity; Datasheet Link: https://componentsearchengine.com/Datasheets/1/1825232-1.pdf; Height: 3.7mm; Manufacturer_Part_Number: 1825232-1; Mouser Part Number: 655-1825232-1; Mouser Price/Stock: https://www.mouser.co.uk/ProductDetail/TE-Connectivity-PB/1825232-1?qs=kTKVN3NWb5FosGxaNC1%252BtA%3D%3D; Arrow Part Number: 1825232-1; Arrow Price/Stock: https://www.arrow.com/en/products/1825232-1/te-connectivity?region=europe